# EAGLE board The Flying Jalapeno (EAGLE 7.6.0)
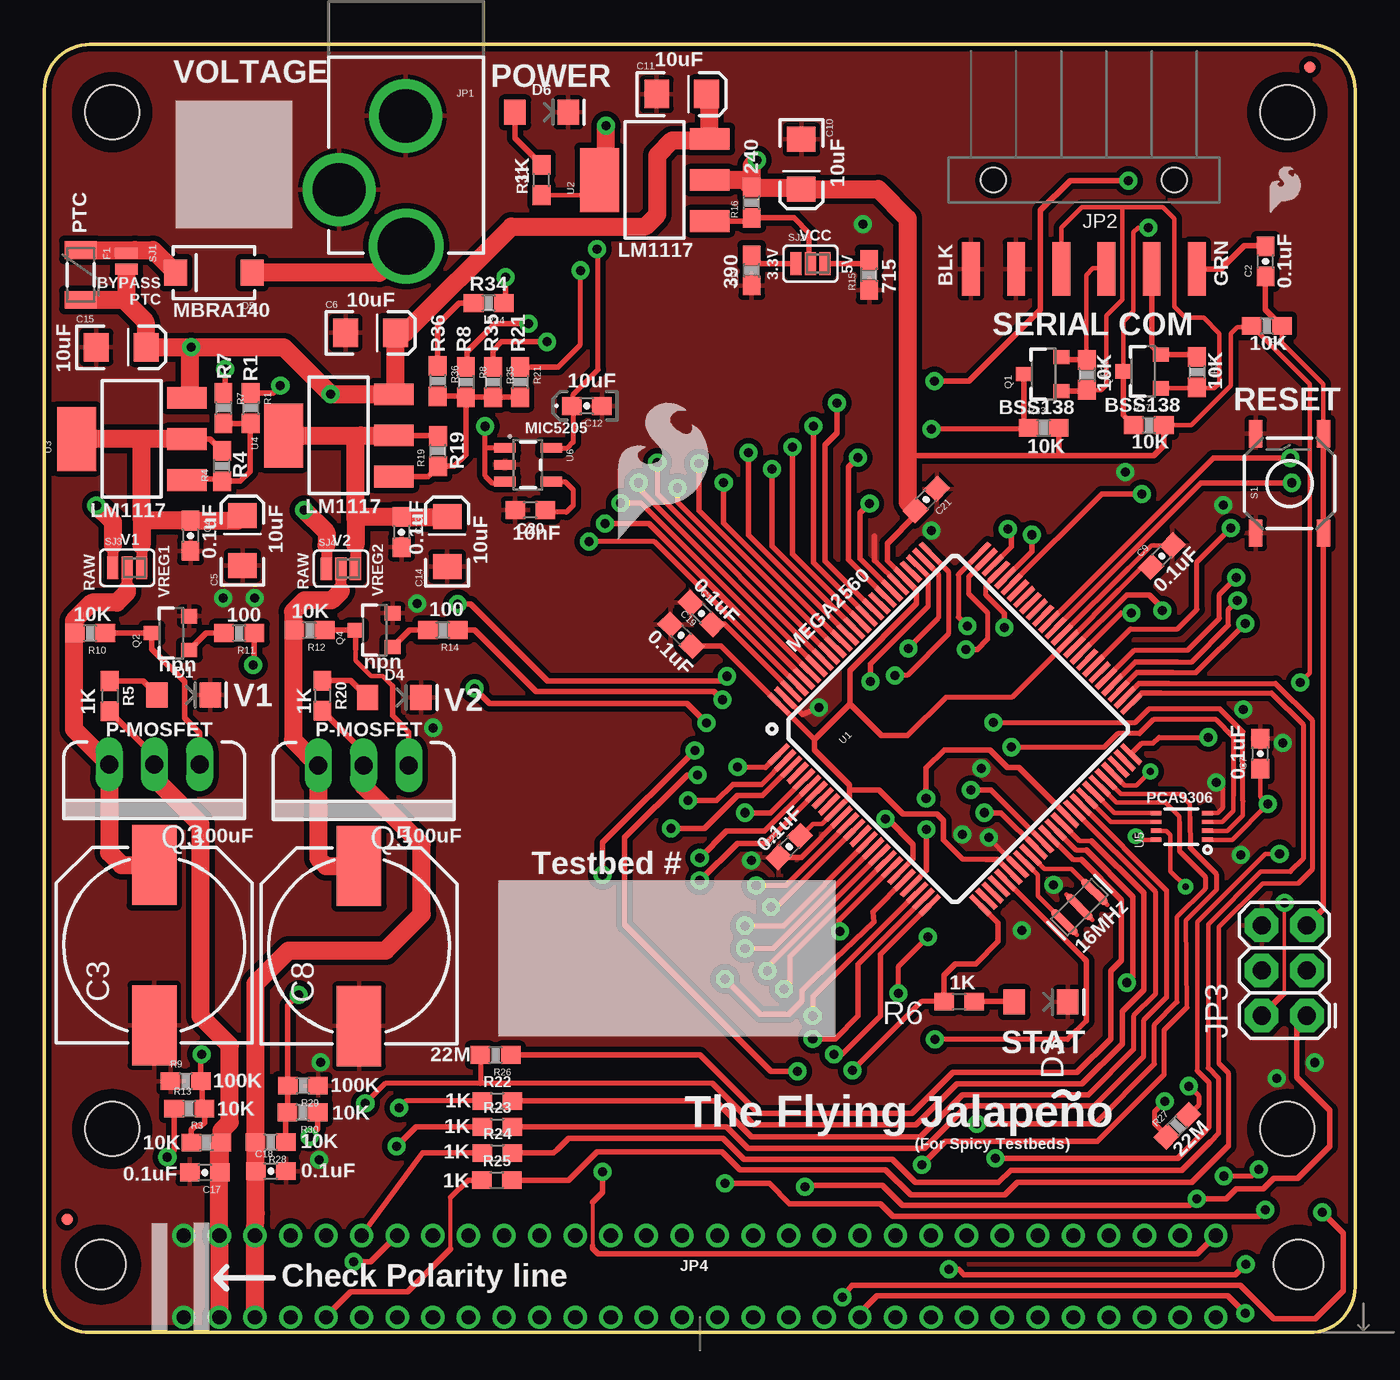
[diagram p1: board, top side]
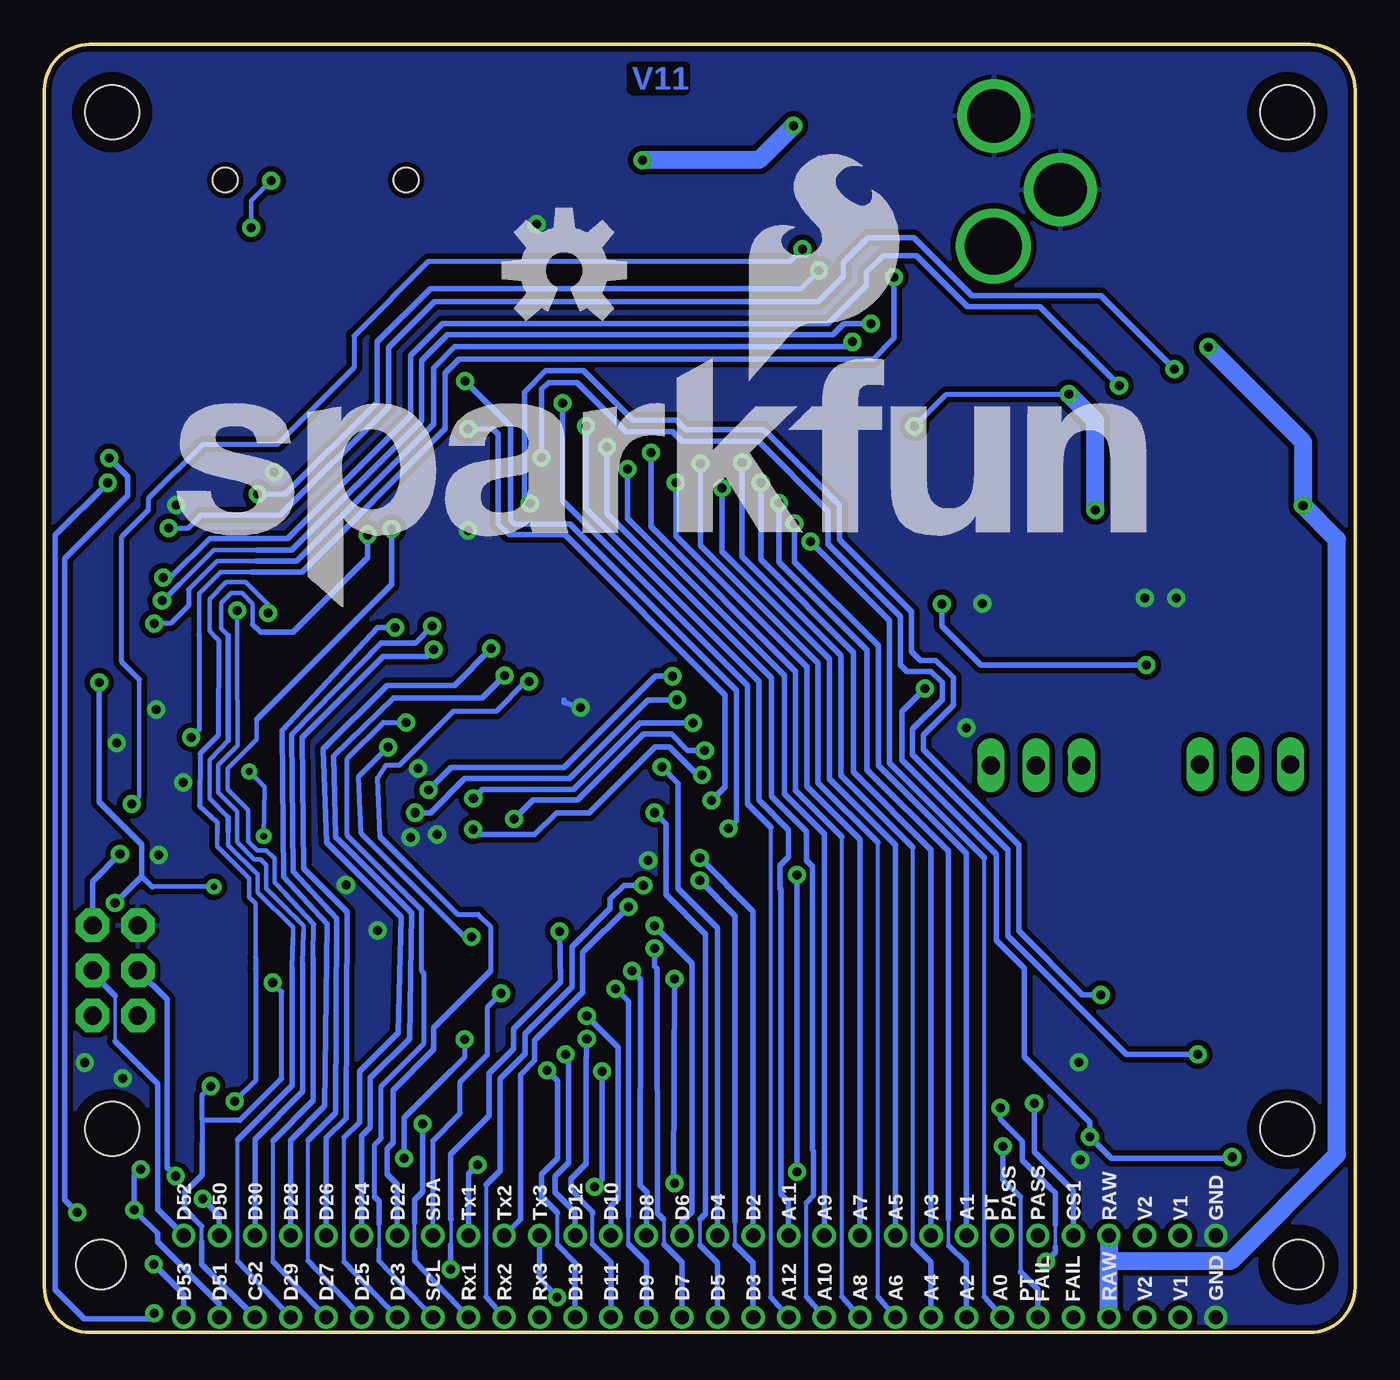
[diagram p2: board, bottom side, seen from below]

Size 73.66 x 72.39 mm. Coordinates in mm from the lower left corner, seen from the top.
Outline: 0,69.85 0,2.54 arc90 2.54,0 71.12,0 arc90 73.66,2.54 73.66,69.85 arc90 71.12,72.39 2.54,72.39 arc90 0,69.85
Copper layers (1*16): Top 0.035mm / dielectric 1.5mm / Bottom 0.035mm
Design rules "SparkFun *": minimum track width 7mil, minimum drill 15mil, track to track 8mil, track to pad 8mil, pad to pad 8mil, via to via 8mil, smd to smd 8mil, copper to edge 8mil, drill to drill 8mil, minimum pad ring 10mil, minimum via ring 10mil, stop-mask expansion 4mil, vias tented up to drill 20mil, thermal gap 10mil
Net classes: 0 default: width 0.203 mm; 1 BIG: width 0.203 mm; 2 POWER: width 0.203 mm; 10 12_mil: width 0.305 mm, drill 0.381 mm; 11 15_mil: width 0.381 mm, drill 0.381 mm
tRestrict: area 65.2,29.4 to 65.5,29.4

## Footprints (pad centres in the part's own frame; a part is rotated, then mirrored left to right if it is on the bottom)
0603-CAP = smd 1.1 x 1: 1 -0.85,0; 2 0.85,0
NIC_10X10.5_CAP = smd 4.5 x 2.5: + 4.5,0; - -4.5,0
EIA3216 = smd 1.4 x 1.6: A 1.4,0; C -1.4,0
0603-POL = smd 1.1 x 1: A 0.85,0; K -0.85,0
0603 = smd 1.1 x 1: 1 -0.85,0; 2 0.85,0
LED-1206 = smd 1.2 x 1.4: A -1.5,0; C 1.5,0
SMA-DIODE = smd 1.27 x 1.47: A -2.15,0; C 2.15,0
PTC-1206 = smd 1 x 1.8: 1 -1.4,0; 2 1.4,0
POWER_JACK_PTH_LOCK = drill 2.997 pad 4.115: GND 0.025,6.557; GNDBREAK 3.762,10.7 | drill 3.2 pad 4.115: PWR 0,13.878
FTDI_DEVICE_RA_SMT = smd 1 x 3: 1 -6.35,5; 2 -3.81,5; 3 -1.27,5; 4 1.27,5; 5 3.81,5; 6 6.35,5 | hole 1.4: -5.08,0; 5.08,0
2X3 = drill 1.016 pad 1.88 octagon: 1 0,0; 2 0,2.54; 3 2.54,0; 4 2.54,2.54; 5 5.08,0; 6 5.08,2.54
FLYING_JALAPENO_V3_F = drill 0.8 pad 1.25: 1 -29,5.45; 2 -27,5.45; 3 -25,5.45; 4 -23,5.45; 5 -21,5.45; 6 -19,5.45; 7 -17,5.45; 8 -15,5.45; 9 -13,5.45; 10 -11,5.45; 11 -9,5.45; 12 -7,5.45; 13 -5,5.45; 14 -3,5.45; 15 -1,5.45; 16 1,5.45; 17 3,5.45; 18 5,5.45; 19 7,5.45; 20 9,5.45; 21 11,5.45; 22 13,5.45; 23 15,5.45; 24 17,5.45; 25 19,5.45; 26 21,5.45; 27 23,5.45; 28 25,5.45; 29 27,5.45; 30 29,5.45; 31 -29,0.85; 32 -27,0.85; 33 -25,0.85; 34 -23,0.85; 35 -21,0.85; 36 -19,0.85; 37 -17,0.85; 38 -15,0.85; 39 -13,0.85; 40 -11,0.85; 41 -9,0.85; 42 -7,0.85; 43 -5,0.85; 44 -3,0.85; 45 -1,0.85; 46 1,0.85; 47 3,0.85; 48 5,0.85; 49 7,0.85; 50 9,0.85; 51 11,0.85; 52 13,0.85; 53 15,0.85; 54 17,0.85; 55 19,0.85; 56 21,0.85; 57 23,0.85; 58 25,0.85; 59 27,0.85; 60 29,0.85 | hole 2.794: 33.655,3.81; -33.655,3.81
MICRO-FIDUCIAL = smd 0.635 x 0.635: 1 0,0
SOT23-3 = smd 0.8 x 0.9: 1 -0.95,-1; 2 0.95,-1; 3 0,1.1
TO220V = drill 1.016 long: 1 -2.54,0; 2 0,0; 3 2.54,0
0603-RES = smd 1.1 x 1: 1 -0.85,0; 2 0.85,0
TACTILE-SWITCH-SMD = smd 1.524 x 0.762: 1 -2.794,1.905; 2 2.794,1.905; 3 -2.794,-1.905; 4 2.794,-1.905
PAD-JUMPER-2-NO_NO_SILK = smd 0.635 x 1.27: 1 -0.45,0; 2 0.45,0
PAD-JUMPER-3-2OF3_NC_BY_PASTE_YES_SILK_FULL_BOX = smd 0.635 x 1.27: 1 -0.813,0; 2 0,0; 3 0.813,0
STAND-OFF-TIGHT = hole 3.048: 0,0
TQFP100 = smd 1.5 x 0.3: 1 -8,6; 2 -8,5.5; 3 -8,5; 4 -8,4.5; 5 -8,4; 6 -8,3.5; 7 -8,3; 8 -8,2.5; 9 -8,2; 10 -8,1.5; 11 -8,1; 12 -8,0.5; 13 -8,0; 14 -8,-0.5; 15 -8,-1; 16 -8,-1.5; 17 -8,-2; 18 -8,-2.5; 19 -8,-3; 20 -8,-3.5; 21 -8,-4; 22 -8,-4.5; 23 -8,-5; 24 -8,-5.5; 25 -8,-6; 51 8,-6; 52 8,-5.5; 53 8,-5; 54 8,-4.5; 55 8,-4; 56 8,-3.5; 57 8,-3; 58 8,-2.5; 59 8,-2; 60 8,-1.5; 61 8,-1; 62 8,-0.5; 63 8,0; 64 8,0.5; 65 8,1; 66 8,1.5; 67 8,2; 68 8,2.5; 69 8,3; 70 8,3.5; 71 8,4; 72 8,4.5; 73 8,5; 74 8,5.5; 75 8,6 | smd 0.3 x 1.5: 26 -6,-8; 27 -5.5,-8; 28 -5,-8; 29 -4.5,-8; 30 -4,-8; 31 -3.5,-8; 32 -3,-8; 33 -2.5,-8; 34 -2,-8; 35 -1.5,-8; 36 -1,-8; 37 -0.5,-8; 38 0,-8; 39 0.5,-8; 40 1,-8; 41 1.5,-8; 42 2,-8; 43 2.5,-8; 44 3,-8; 45 3.5,-8; 46 4,-8; 47 4.5,-8; 48 5,-8; 49 5.5,-8; 50 6,-8; 76 6,8; 77 5.5,8; 78 5,8; 79 4.5,8; 80 4,8; 81 3.5,8; 82 3,8; 83 2.5,8; 84 2,8; 85 1.5,8; 86 1,8; 87 0.5,8; 88 0,8; 89 -0.5,8; 90 -1,8; 91 -1.5,8; 92 -2,8; 93 -2.5,8; 94 -3,8; 95 -3.5,8; 96 -4,8; 97 -4.5,8; 98 -5,8; 99 -5.5,8; 100 -6,8
SOT223 = smd 1.219 x 2.235: 1 -2.311,-3.099; 2 0,-3.099; 3 2.311,-3.099 | smd 3.6 x 2.2: 4 0,3.099
PCA9306DC-1:1 = smd 0.25 x 0.602: 1 -0.73,-1.446; 2 -0.23,-1.446; 3 0.27,-1.446; 4 0.77,-1.446; 5 0.77,1.431; 6 0.27,1.431; 7 -0.23,1.431; 8 -0.73,1.431
SOT23-5 = smd 0.55 x 1.2: 1 -0.95,-1.3; 2 0,-1.3; 3 0.95,-1.3; 4 0.95,1.3; 5 -0.95,1.3
RESONATOR-SMD = smd 0.45 x 1.905: 1 -1.2,0; 2 0,0; 3 1.2,0

## Placement (x,y rotation side)
C1  0.1uF  [0603-CAP]  36.93,40.41 315 top
C2  0.1uF  [0603-CAP]  68.63,60.2 90 top
C3  100uF  [NIC_10X10.5_CAP]  6.17,21.77 90 top
C4  0.1uF  [0603-CAP]  8.2,44.78 270 top
C5  10uF  [EIA3216]  11.13,44.5 90 top
C6  10uF  [EIA3216]  18.33,56.18 0 top
C7  0.1uF  [0603-CAP]  68.34,32.53 90 top
C8  100uF  [NIC_10X10.5_CAP]  17.68,21.72 90 top
C9  0.1uF  [0603-CAP]  62.79,43.64 45 top
C10  10uF  [EIA3216]  42.55,65.66 270 top
C11  10uF  [EIA3216]  35.81,69.6 0 top
C12  10uF  [0603-POL]  30.48,52.07 180 top
C13  0.1uF  [0603-CAP]  20.07,44.98 270 top
C14  10uF  [EIA3216]  22.63,44.45 90 top
C15  10uF  [EIA3216]  4.32,55.37 0 top
C17  0.1uF  [0603-CAP]  9.02,8.99 180 top
C18  0.1uF  [0603-CAP]  12.73,9.07 0 top
C19  0.1uF  [0603-CAP]  35.78,39.19 315 top
C20  10nF  [0603]  27.3,46.23 180 top
C21  0.1uF  [0603-CAP]  49.56,46.81 225 top
C22  0.1uF  [0603-CAP]  41.86,27.3 45 top
D1  RED  [LED-1206]  7.82,35.83 0 top
D3  RED  [LED-1206]  56.01,18.57 0 top
D4  RED  [LED-1206]  19.66,35.69 0 top
D5  MBRA140  [SMA-DIODE]  9.53,59.56 180 top
D6  RED  [LED-1206]  27.94,68.58 0 top
F1  [PTC-1206]  2.03,59.44 270 top
FRAME1  FRAME-LEDGER  [CREATIVE_COMMONS]  -1.27,-12.7 0 top  (outside the outline)
JP1  7V  [POWER_JACK_PTH_LOCK]  20.32,74.93 180 top
JP2  FTDI  [FTDI_DEVICE_RA_SMT]  58.42,64.77 180 top
JP3  [2X3]  70.95,17.81 90 top
JP4  2x30 RA FEMALE HEADER  [FLYING_JALAPENO_V3_F]  36.83,0 0 top
JP5  FIDUCIALUFIDUCIAL  [MICRO-FIDUCIAL]  1.27,6.35 90 top
JP8  FIDUCIALUFIDUCIAL  [MICRO-FIDUCIAL]  71.12,71.12 90 top
LOGO1  SFE_LOGO_NAME_FLAME.5_INCH  [SFE_LOGO_NAME_FLAME_.5]  67.03,40.46 0 bottom
LOGO2  SFE_LOGO_FLAME.3_INCH  [SFE_LOGO_FLAME_.3]  31.75,44.45 0 top
LOGO3  SFE_LOGO_FLAME.1_INCH  [SFE_LOGO_FLAME_.1]  68.58,62.61 0 top
LOGO4  OSHW-LOGOL  [OSHW-LOGO-L]  44.45,59.69 0 bottom
Q1  BSS138, 200mA/50V  [SOT23-3]  56.15,53.86 90 top
Q2  MMBT2222A  [SOT23-3]  7.14,39.31 90 top
Q3  NDP6020P  [TO220V]  6.17,31.93 180 top
Q4  MMBT2222A  [SOT23-3]  18.58,39.47 90 top
Q5  NDP6020P  [TO220V]  17.93,31.88 180 top
Q6  BSS138, 200mA/50V  [SOT23-3]  61.73,54.01 90 top
R1  715  [0603-RES]  11.58,51.94 270 top
R2  10K  [0603-RES]  68.7,56.57 180 top
R3  10K  [0603-RES]  9.11,10.67 0 top
R4  240  [0603-RES]  9.98,48.69 90 top
R5  1k  [0603]  3.67,35.76 270 top
R6  1k  [0603]  51.41,18.59 0 top
R7  390  [0603-RES]  10.06,51.94 270 top
R8  390  [0603-RES]  23.69,53.42 270 top
R9  100k  [0603-RES]  7.94,14.12 0 top
R10  10K  [0603-RES]  2.57,39.31 180 top
R11  100  [0603-RES]  10.95,39.31 180 top
R12  10K  [0603-RES]  14.9,39.47 180 top
R13  10K  [0603-RES]  8.14,12.59 0 top
R14  100  [0603-RES]  22.39,39.47 180 top
R15  715  [0603-RES]  46.35,59.44 90 top
R16  240  [0603-RES]  39.75,63.5 90 top
R17  10K  [0603-RES]  62.06,50.99 0 top
R18  390  [0603-RES]  39.75,59.69 90 top
R19  240  [0603-RES]  22.12,49.53 90 top
R20  1k  [0603]  15.62,35.79 270 top
R21  715  [0603-RES]  26.73,53.42 270 top
R22  1k  [0603]  25.45,13 0 top
R23  1k  [0603]  25.45,11.56 0 top
R24  1k  [0603]  25.45,10.08 0 top
R25  1k  [0603]  25.43,8.56 0 top
R26  22M  [0603-RES]  25.35,15.6 180 top
R27  22M  [0603-RES]  63.68,11.61 45 top
R28  10K  [0603-RES]  12.71,10.69 180 top
R29  100k  [0603-RES]  14.53,13.87 180 top
R30  10K  [0603-RES]  14.5,12.37 180 top
R31  1k  [0603]  27.94,64.77 90 top
R32  10K  [0603-RES]  58.59,53.82 270 top
R33  10K  [0603-RES]  56.16,50.84 0 top
R34  100  [0603-RES]  24.97,57.85 180 top
R35  470  [0603-RES]  25.21,53.42 270 top
R36  470  [0603-RES]  22.1,53.47 270 top
R37  10K  [0603-RES]  64.77,53.98 270 top
S1  [TACTILE-SWITCH-SMD]  69.98,47.71 90 top
SJ1  PTC Bypass  [PAD-JUMPER-2-NO_NO_SILK]  4.61,60.21 270 top
SJ2  [PAD-JUMPER-3-2OF3_NC_BY_PASTE_YES_SILK_FULL_BOX]  43.05,60.07 0 top
SJ3  [PAD-JUMPER-3-2OF3_NC_BY_PASTE_YES_SILK_FULL_BOX]  4.65,42.98 0 top
SJ4  [PAD-JUMPER-3-2OF3_NC_BY_PASTE_YES_SILK_FULL_BOX]  16.66,42.93 0 top
STANDOFF1  STAND-OFFTIGHT  [STAND-OFF-TIGHT]  3.81,11.43 0 top
STANDOFF2  STAND-OFFTIGHT  [STAND-OFF-TIGHT]  69.85,11.43 0 top
STANDOFF3  STAND-OFFTIGHT  [STAND-OFF-TIGHT]  69.85,68.58 0 top
STANDOFF4  STAND-OFFTIGHT  [STAND-OFF-TIGHT]  3.81,68.58 0 top
U1  ATMEGA2560AU  [TQFP100]  51.17,33.92 45 top
U2  LM1117  [SOT223]  34.29,64.77 90 top
U3  LM1117  [SOT223]  4.9,50.22 90 top
U4  LM1117  [SOT223]  16.54,50.42 90 top
U5  PCA9306  [PCA9306DC-1:1]  63.91,28.42 90 top
U6  3.3V MIC5205  [SOT23-5]  27.18,48.77 270 top
Y1  16MHZ  [RESONATOR-SMD]  58.17,23.91 225 top

## Tracks (layer width: path | path; a pad name or v marks a point on that pad's centre or on a via)
3.3V  (via drill 0.51)
  Top 0.254: U5.1 66.76,27.69 v68.76,29.69 68.34,30.11 C7.1
  Top 0.279: U6.5 29.4,49.72 29.72,50.04 29.72,51.98 | 29.72,51.98 C12.A | 29.72,51.98 29.72,52.7 31.11,54.1 31.11,60.81 v31.05,60.88
  Bottom 0.254: 68.33,36.7 68.33,30.12 v68.76,29.69
  Bottom 0.279: 68.33,36.7 69.34,37.72 69.34,44.7 67.82,46.23 67.82,46.86 64.77,49.91 60.58,49.91 56.26,54.23 56.26,56.01 52.07,60.2 31.73,60.2 v31.05,60.88
31/CAPRETURN2  (via drill 0.51)
  Top 0.279: U1.59 60.52,40.44 v61.09,40.44 | R27.1 63.08,11.04 62.41,11.71 62.41,12.42 v62.97,12.98
  Bottom 0.254: 64.01,39.04 64.39,39.42 64.39,41.22 63.45,42.16 62.36,42.16 61.01,40.82 v61.09,40.44 | 63.94,28.04 63.94,27.32 62.15,25.53 62.15,24.46 61.8,24.11 61.8,20.47
  Bottom 0.279: 64.01,39.04 63.88,38.91 63.91,33.55 64.92,32.54 64.95,29.59 63.94,28.69 63.94,28.04 | 61.8,21.08 61.8,20.47 61.8,14.14 v62.97,12.98
33/V1_3.3V  (via drill 0.51)
  Top 0.279: U1.57 61.04,39.55 63.68,39.55 64.77,40.64 64.77,43.31 v66.67,45.21
  Top 0.305: v10.16,54.15 10.16,52.9 R7.1
  Bottom 0.279: v66.67,45.21 65.58,45.21 64.99,45.81
  Bottom 0.305: 64.99,45.81 64.85,45.95 60.4,45.95 54.33,52.02 54.33,55.35 51.74,57.94 30.18,57.94 28.75,59.36 28.75,60.15 27.38,61.52 24.79,61.52 21.54,58.27 14.28,58.27 v10.16,54.15
35/V1_5V  (via drill 0.51)
  Top 0.279: U1.55 61.27,38.35 64.26,38.35 66.04,40.13 66.04,41.48 v66.98,42.42
  Top 0.305: 12.97,52.92 v13.26,53.21 12.84,52.79 R1.1
  Bottom 0.279: 64.39,44.63 66.6,42.42 v66.98,42.42
  Bottom 0.305: 64.39,44.63 59.99,44.63 53.09,51.54 53.09,54.89 51.28,56.69 29.62,56.69 27.46,58.85 27.46,59.59 26.52,60.53 24.66,60.53 21.79,57.66 17.7,57.66 v13.26,53.21
36/V2_3.3V  (via drill 0.51)
  Top 0.279: U1.54 61.31,37.69 | 63.68,37.69 64.49,37.69 66.55,39.75 66.55,40.64 v67.06,41.15
  Top 0.305: 61.31,37.69 63.68,37.69 | R8.1 23.75,54.33 23.75,55.12 25.32,56.69 v27.2,56.69
  Bottom 0.254: 66.09,42.04 64.16,43.97 61.7,43.97
  Bottom 0.279: 66.09,42.04 66.98,41.15 v67.06,41.15
  Bottom 0.305: 61.7,43.97 59.77,43.97 52.48,51.26 52.48,54.61 51,56.08 29.34,56.08 28.73,56.69 v27.2,56.69
37/V2_3.7V  (via drill 0.51)
  Top 0.279: U1.53 61.41,37.08 | 63.42,37.08 64.72,37.08 v67.49,39.85
  Top 0.305: 61.41,37.08 63.42,37.08 | R35.1 25.21,55.18 25.7,55.68 v28.25,55.68
  Bottom 0.254: 61.77,43.36 63.96,43.36 65.56,41.76
  Bottom 0.279: 65.56,41.76 65.56,40.87 66.57,39.85 v67.49,39.85
  Bottom 0.305: 61.77,43.36 59.49,43.36 51.79,51.05 51.79,54.2 50.6,55.4 28.52,55.4 v28.25,55.68
38/V2_4.2V  (via drill 0.51)
  Top 0.279: U1.50 61.69,33.12 62.31,33.12 62.64,33.45 v65.41,33.45
  Top 0.305: v25.91,59.31 25.91,57.94 R34.1
  Bottom 0.254: 64.97,39.22 64.97,41.53 63.75,42.75 62,42.75
  Bottom 0.279: 64.97,39.22 64.97,33.88 v65.41,33.45
  Bottom 0.305: 62,42.75 59.18,42.75 51.13,50.8 51.13,53.92 50.34,54.71 27.08,54.71 25.91,55.88 v25.91,59.31
39/V2_5V  (via drill 0.51)
  Top 0.279: U1.70 59.42,47.12 | 28.87,54.27 30.12,55.52 v30.12,59.69
  Top 0.305: 59.42,47.12 v61.67,47.12 | R21.1 28.87,54.27
  Bottom 0.279: 31.52,58.67 31.14,58.67 v30.12,59.69
  Bottom 0.305: v61.67,47.12 60.12,47.12 54.97,52.27 54.97,55.68 51.97,58.67 31.52,58.67
40/FAIL
  Top 0.254: 66.02,15.11 66.02,22.78 68.48,25.25 70.48,25.25
  Top 0.279: U1.52 61.51,36.47 | 63.17,36.47 69.19,36.47 71.25,34.42 71.25,26.01 70.48,25.25 | 66.02,15.11 66.53,14.59 66.53,10.48
  Top 0.305: R25.2 29.46,8.56 31.06,10.16 38.08,10.16 39.09,9.14 47.27,9.14 48.69,7.72 53.98,7.72 54.69,8.43 64.49,8.43 66.53,10.48 | 61.51,36.47 63.17,36.47
41/PASS
  Top 0.254: 65.41,14.86 65.41,22.94 68.38,25.91 70.03,25.91
  Top 0.279: U1.51 61.68,35.94 | 62.74,35.94 68.96,35.94 70.74,34.16 70.74,26.62 70.03,25.91 | 65.41,14.86 65.99,14.28 65.99,11.18 65.52,10.71
  Top 0.305: 65.52,10.71 63.93,9.12 54.3,9.12 53.62,8.43 48.95,8.43 47.65,9.73 39.32,9.73 38.12,10.92 29.46,10.92 28.96,10.41 28.83,10.29 28.63,10.08 R24.2 | 62.74,35.94 61.68,35.94
42/PT_FAIL
  Top 0.279: U1.42 63.07,24.85 63.07,18.82 61.77,17.53 61.77,15.49 59,12.72
  Top 0.305: R23.2 38.33,11.56 39.55,10.34 49.45,10.34 51.84,12.72 59,12.72
43/PT_PASS
  Top 0.279: U1.41 62.43,24.78 62.43,19 61.21,17.78 61.21,15.9 58.67,13.36
  Top 0.305: R22.2 37.72,13.01 39.73,11 49.23,11 51.59,13.36 58.67,13.36
44/PT_CTRL  (via drill 0.51)
  Top 0.305: U1.40 54.75,31.75 54.13,31.75 53.14,32.74 50.57,32.74 49.55,31.73 v49.55,30.02 | v37.21,34.27 36.12,35.36 25.02,35.36 v24.18,36.2 | 7.16,10.11 v6.91,9.86 7.29,10.24 R13.1 | R30.1 15.35,11.44 v14.91,11
  Bottom 0.305: v49.55,30.02 49.05,30.53 43.92,30.53 40.18,34.27 v37.21,34.27 | v24.18,36.2 25.48,34.9 25.48,32.18 20.17,26.87 20.17,22.02 18.59,20.45 18.59,15.49 14.91,11.81 v14.91,11 13.69,9.78 6.99,9.78 v6.91,9.86
45/CAPSENSE1  (via drill 0.51)
  Top 0.279: U1.39 58.14,27.66 58.85,27.62 | 37.54,13.99 24.5,13.99 | 24.5,13.99 19.15,13.99 v18.03,12.88 | R26.2 24.5,13.99
  Top 0.305: 58.85,27.62 61.8,24.69 61.8,19.25 60.58,18.03 60.58,16.23 58.32,13.97 51.28,13.97 48.97,11.66 39.88,11.66 37.54,13.99
  Bottom 0.305: v18.03,12.88 18.03,10.16 15.83,7.96 JP4.5
46/CAPSENSE2  (via drill 0.51)
  Top 0.279: U1.38 57.96,27.13 58.55,27.13 | 64.41,12.34 R27.2 | 64.41,12.34 | 64.41,12.34 64.9,12.83 64.9,13.26 v64.31,13.84
  Top 0.305: 58.55,27.13 61.16,24.49 61.16,19.99 v60.83,19.66
  Bottom 0.229: 64.82,5.08 64.82,5.97
  Bottom 0.279: 64.8,11.91 62.69,11.91 60.33,14.28 60.33,19.15 v60.83,19.66 | 64.8,11.91 64.8,10.62 | 64.8,11.91 64.8,13.36 v64.31,13.84
  Bottom 0.305: JP4.58 64.82,3.84 64.82,5.08 | 64.8,10.62 64.8,8.87 65.79,7.87 65.79,6.93 64.82,5.97
47/CAPRETURN1
  Top 0.279: U1.37 57.79,26.59 58.27,26.59
  Top 0.305: 58.27,26.59 60.53,24.31 60.53,20.9 59.94,20.32 59.94,16.51 58.04,14.61 51.05,14.61 48.77,12.32 40.13,12.32 36.85,15.6 R26.1
48/PWR_CTRL_1  (via drill 0.51)
  Top 0.279: U1.36 53.2,30.48
  Top 0.305: 53.2,30.48 v52.07,30.48 | v11.73,37.52 11.8,37.58 R11.1 | v38.35,36.88 38.1,36.63 28.27,36.63 23.95,40.95 v23.22,40.95
  Bottom 0.305: v52.07,30.48 50.8,31.75 44.45,31.75 39.32,36.88 v38.35,36.88 | v11.73,37.52 21.03,37.52 23.22,39.7 v23.22,40.95
49/PWR_CTRL_2  (via drill 0.51)
  Top 0.279: U1.35 53.76,29.21
  Top 0.305: 53.76,29.21 v52.83,29.21 | v38.1,35.56 37.64,36.02 27.64,36.02 24.18,39.47 R14.1
  Bottom 0.305: v38.1,35.56 39.73,35.56 44.15,31.14 50.04,31.14 51.97,29.21 v52.83,29.21
A0  (via drill 0.51)
  Top 0.279: U1.97 34.28,44.45 v30.61,44.45
  Bottom 0.229: 20.83,2 20.83,26.67
  Bottom 0.305: JP4.37 20.83,2 | 20.83,26.67 26.16,32 26.16,40.01 v30.61,44.45
A1  (via drill 0.51)
  Top 0.305: U1.96 33.97,45.47 v31.5,45.47
  Bottom 0.305: JP4.8 21.83,26.91 26.8,31.88 26.8,38.61 31.5,43.31 v31.5,45.47
A2  (via drill 0.51)
  Top 0.279: U1.95 33.53,46.61
  Top 0.305: 33.53,46.61 v32.38,46.61
  Bottom 0.203: 22.86,6.35 22.86,4.9 22.84,4.88
  Bottom 0.305: JP4.38 21.83,3.92 22.84,4.88 | v32.38,46.61 32.38,43.31 27.43,38.35 27.43,31.62 22.86,27.05 22.86,6.35
A3  (via drill 0.51)
  Top 0.279: U1.94 33.4,47.45
  Top 0.305: 33.4,47.45 v33.4,47.75
  Bottom 0.305: JP4.9 23.83,27.13 28.19,31.5 28.19,38.23 33.4,43.43 v33.4,47.75
A4  (via drill 0.51)
  Top 0.279: U1.93 34.44,47.11
  Top 0.305: 34.44,47.11 v34.44,48.9
  Bottom 0.229: 24.84,4.95 24.84,27.25
  Bottom 0.305: JP4.39 23.83,3.94 24.84,4.95 | 24.84,27.25 28.88,31.29 28.88,38.05 34.44,43.61 v34.44,48.9
A5  (via drill 0.51)
  Top 0.279: U1.92 35.59,46.68
  Top 0.305: 35.59,46.68 v35.59,47.45
  Bottom 0.305: JP4.10 25.83,27.41 29.54,31.11 29.54,37.85 35.59,43.89 v35.59,47.45
A6  (via drill 0.51)
  Top 0.279: 36.78,46.19 U1.91
  Top 0.305: v36.78,48.84 36.78,46.19
  Bottom 0.229: 26.82,1.99 26.82,27.53
  Bottom 0.305: JP4.40 26.82,1.99 | 26.82,27.53 30.18,30.89 30.18,37.62 36.78,44.22 v36.78,48.84
A7  (via drill 0.51)
  Top 0.279: 38.18,45.5 U1.90
  Top 0.305: v38.18,47.78 38.18,45.5
  Bottom 0.305: JP4.11 27.83,27.7 30.81,30.68 30.81,37.39 38.18,44.76 v38.18,47.78
A8  (via drill 0.51)
  Top 0.279: 39.57,44.81 U1.89
  Top 0.305: v39.57,49.45 39.57,44.81
  Bottom 0.229: 28.83,2 28.83,27.84
  Bottom 0.305: JP4.41 28.83,2 | 28.83,27.84 31.45,30.45 31.45,37.16 39.57,45.29 v39.57,49.45
A9  (via drill 0.51)
  Top 0.279: 40.89,44.2 U1.88
  Top 0.305: v40.89,48.51 40.89,44.2
  Bottom 0.305: JP4.12 29.83,28.03 32.08,30.28 32.08,36.93 40.89,45.74 v40.89,48.51
A10  (via drill 0.51)
  Top 0.279: 42.04,43.76 U1.87
  Top 0.305: v42.04,49.76 42.04,43.76
  Bottom 0.229: 30.84,2.01 30.84,7.29
  Bottom 0.305: JP4.42 30.84,2.01 | 30.84,7.29 30.43,7.7 30.43,10.19 30.5,10.26 30.5,26.19 30.84,26.52 30.84,28.17 32.79,30.12 32.79,36.78 42.04,46.02 v42.04,49.76
A11  (via drill 0.51)
  Top 0.279: 43.23,43.27 U1.86
  Top 0.305: v43.23,50.95 43.23,43.27
  Bottom 0.305: JP4.13 31.83,7.34 32.26,7.77 32.26,8.89 32.26,8.99 32.26,24.89 32.31,24.94 32.31,26.24 31.83,26.72 31.83,28.25 33.5,29.92 33.5,36.58 43.23,46.3 v43.23,50.95
A12  (via drill 0.51)
  Top 0.279: 43.87,43.35 U1.85
  Top 0.305: v44.55,52.22 44.55,50.55 43.87,49.86 43.87,43.35
  Bottom 0.229: 32.82,1.99 32.82,28.37
  Bottom 0.305: JP4.43 32.82,1.99 | 32.82,28.37 34.14,29.69 34.14,36.35 44.55,46.76 v44.55,52.22
A14/PT_READ_V1  (via drill 0.51)
  Top 0.279: U1.83 45.19,43.44
  Top 0.305: 45.19,43.44 45.19,48.64 v45.72,49.17 | v8.84,15.62 8.79,15.57 R9.2 8.86,13.79 8.86,12.71 R13.2 8.99,11.79 8.81,11.61 8.48,11.61 8.26,11.38 R3.1
  Bottom 0.305: v45.72,49.17 45.72,53.01 45.34,53.39 43.74,53.39 40.97,50.62 38.35,50.62 37.82,50.09 33.53,50.09 29.62,46.18 29.62,44.3 25.55,40.23 25.55,37.52 25.2,37.16 23.82,37.16 23.19,36.52 23.19,35.59 24.87,33.91 24.87,32.49 19.51,27.13 19.51,22.28 12.85,15.62 v8.84,15.62
A15/PT_READ_V2  (via drill 0.51)
  Top 0.279: U1.82 45.85,43.49
  Top 0.305: R28.1 13.56,12.28 R30.2 13.65,13.84 R29.2 13.68,18.38 v14.28,18.97 | 45.85,43.49 45.85,46.05 v46.38,46.58
  Bottom 0.305: v46.38,46.58 46.69,46.89 46.69,52.86 45.49,54.05 43.36,54.05 40.59,51.28 38.12,51.28 37.59,50.75 33.22,50.75 28.98,46.51 28.98,44.55 24.94,40.51 24.94,38.28 24.43,37.77 23.55,37.77 22.58,36.8 22.58,35.26 24.26,33.58 24.26,32.77 18.9,27.41 18.9,22.55 15.32,18.97 v14.28,18.97
AREF
  Top 0.279: U1.98 38.21,39.81
  Top 0.305: 38.21,39.81 C1.2
D2  (via drill 0.51)
  Top 0.279: 40.48,28.18 U1.6
  Top 0.305: v36.83,26.67 38.34,28.18 40.48,28.18
  Bottom 0.305: JP4.14 33.83,23.67 v36.83,26.67
D3  (via drill 0.51)
  Top 0.279: 40.53,27.49 U1.7
  Top 0.305: v36.83,25.4 38.95,27.49 40.53,27.49
  Bottom 0.203: 34.85,6.25 34.85,4.93
  Bottom 0.305: JP4.44 33.83,3.91 34.65,4.72 34.85,4.93 | v36.83,25.4 34.85,23.42 34.85,6.25
D4  (via drill 0.51)
  Top 0.279: 40.52,31.75 U1.1
  Top 0.305: v38.96,31.77 40.52,31.75
  Bottom 0.305: JP4.15 35.83,22.72 38.05,24.94 38.05,30.86 v38.96,31.77
D5  (via drill 0.51)
  Top 0.279: 40.81,29.21 U1.5
  Top 0.305: v39.37,29.21 40.81,29.21
  Bottom 0.203: 36.83,6.35 36.83,4.9
  Bottom 0.305: JP4.45 35.83,3.9 36.83,4.9 | v39.37,29.21 38.73,28.57 38.73,24.61 36.5,22.38 36.5,6.68 36.83,6.35
D6  (via drill 0.51)
  Top 0.279: 41.53,22.86 U1.15
  Top 0.305: v39.37,22.86 41.53,22.86
  Bottom 0.305: v39.37,22.86 37.26,20.75 37.26,6.78 37.83,6.21 JP4.16
D7  (via drill 0.51)
  Top 0.279: 40.97,21.59 U1.16
  Top 0.305: v39.37,21.59 40.97,21.59
  Bottom 0.203: 38.86,6.35 38.84,6.33 38.84,4.95
  Bottom 0.305: JP4.46 37.83,3.95 38.84,4.95 | 38.86,6.35 39.22,6.71 39.24,20.45 39.37,20.57 v39.37,21.59
D8  (via drill 0.51)
  Top 0.279: 40.64,20.56 U1.17
  Top 0.305: v40.64,20.32 40.64,20.56
  Bottom 0.305: JP4.17 39.8,7.87 40.18,8.26 40.16,19.18 40.16,19.84 v40.64,20.32
D9  (via drill 0.51)
  Top 0.279: 41.91,21.12 U1.18
  Top 0.305: 41.91,21.12 41.91,19.66 v41.55,19.3
  Bottom 0.229: 40.84,4.95 40.84,6.55
  Bottom 0.305: JP4.47 39.83,3.94 40.84,4.95 | v41.55,19.3 40.84,18.59 40.84,6.55
D10  (via drill 0.51)
  Top 0.279: 43.18,18.86 U1.23
  Top 0.305: v43.18,17.78 43.18,18.86
  Bottom 0.305: JP4.18 41.83,7.12 41.43,7.52 41.43,16.03 v43.18,17.78
D11  (via drill 0.51)
  Top 0.279: 45.72,20.69 U1.24
  Top 0.305: v43.18,16.51 44.45,16.51 45.72,17.78 45.72,20.69
  Bottom 0.229: 42.85,4.95 42.85,6.66
  Bottom 0.305: JP4.48 41.83,3.93 42.85,4.95 | v43.18,16.51 43.18,15.47 43.23,15.42 43.23,9.47 44.07,8.64 44.07,8 42.85,6.78 42.85,6.66
D12  (via drill 0.51)
  Top 0.279: 46.99,21.25 U1.25 | v44.37,15.62 44.83,15.62 46.99,17.78
  Top 0.305: 46.99,17.78 46.99,21.25
  Bottom 0.305: JP4.19 43.83,6.75 44.96,7.87 44.96,8.76 44.2,9.53 44.2,15.44 v44.37,15.62
D13  (via drill 0.51)
  Top 0.279: U1.26 53.59,23.01 | R6.1 49.28,18.59 v45.41,14.73
  Top 0.305: 53.59,23.01 53.59,21.97 52.35,20.73 51.21,20.73 50.56,20.08 R6.1
  Bottom 0.229: 44.83,4.93 44.83,6.73
  Bottom 0.305: JP4.49 43.83,3.93 44.83,4.93 | 44.83,6.73 45.72,7.62 45.72,8.89 44.83,9.78 44.83,12.19 44.83,14.15 v45.41,14.73
D22  (via drill 0.51)
  Top 0.279: U1.78 49.68,42.48 49.68,40.82 46.43,37.57
  Top 0.305: v46.43,36.58 46.43,37.57
  Bottom 0.279: 54.8,27.84 54.94,31.17 54.48,31.88 53.72,31.88 50.67,34.92 48.26,34.92 46.61,36.58 v46.43,36.58 | 53.02,26.07 50.45,23.5 49.28,23.5 48.59,22.81 48.59,20.32
  Bottom 0.305: 54.8,27.84 53.02,26.07 | JP4.24 53.83,8.31 54.41,8.89 54.41,10.31 54.08,10.64 54.08,13.61 51.79,15.9 51.79,17.12 48.59,20.32
D23  (via drill 0.51)
  Top 0.279: 48.56,38.48 50.24,40.16 50.24,42.63 U1.77
  Top 0.305: v48.56,38.43 48.56,38.48
  Bottom 0.229: 56.82,3.96 56.82,10.97
  Bottom 0.305: JP4.54 56.82,3.96 | 56.82,10.97 55.96,11.81 55.96,14.68 53.8,16.84 53.62,23.34 57.81,27.53 57.99,32.79 54.41,36.37 50.62,36.37 v48.56,38.43
D24  (via drill 0.51)
  Top 0.279: U1.76 50.8,42.77 50.8,39.24 48.49,36.93 v47.8,36.93
  Bottom 0.305: JP4.25 55.83,11.05 55.35,11.53 55.35,14.3 53.14,16.51 53.03,23.57 57.3,27.84 57.4,32.41 54.03,35.66 49.07,35.66 v47.8,36.93
D25  (via drill 0.51)
  Top 0.279: U1.75 51.36,42.59 51.36,40.21 v51.87,39.7
  Bottom 0.229: 58.85,4.02 58.85,10.79
  Bottom 0.305: JP4.55 58.85,4.02 | 58.85,10.79 57.3,12.34 57.23,23.27 59.69,25.91 59.77,33.6 54.74,38.76 52.81,38.76 v51.87,39.7
D26  (via drill 0.51)
  Top 0.279: 53.01,38.96 53.01,40.46 51.94,41.53 51.94,42.47 U1.74
  Top 0.305: 53.01,38.96 52.43,38.38 v51.79,38.38
  Bottom 0.305: JP4.26 57.83,10.93 56.72,12.04 56.64,23.62 59.11,26.09 59.18,33.45 54.63,38 52.17,38 v51.79,38.38
D27  (via drill 0.51)
  Top 0.279: 54.36,44.17 U1.73
  Top 0.305: v54.15,45.16 54.36,44.96 54.36,44.17
  Bottom 0.229: 60.81,3.98 60.81,10.77
  Bottom 0.254: 61.75,34.44 61.75,33.33 63.37,31.7 63.37,30.53 62.21,29.36 62.21,27.59 61.7,27.08 61.19,27.08 60.73,26.64 60.73,25.3 60.11,24.65
  Bottom 0.279: 58.55,21.03 58.52,22.96 60.11,24.65
  Bottom 0.305: JP4.56 60.81,3.98 | 60.81,10.77 58.55,13.03 58.55,21.03 | 61.75,34.44 54.15,42.04 v54.15,45.16
D28  (via drill 0.51)
  Top 0.279: U1.72 52.91,42.02 52.91,41.45 53.95,40.41
  Top 0.305: 53.95,40.41 v53.95,39.62
  Bottom 0.305: JP4.27 59.83,10.81 57.91,12.72 57.78,22.96 60.22,25.6 60.3,33.83 54.94,39.62 v53.95,39.62
D29  (via drill 0.51)
  Top 0.279: 55.5,43.9 U1.71
  Top 0.305: v55.5,44.83 55.5,43.9
  Bottom 0.229: 62.81,3.98 62.81,10.82
  Bottom 0.254: 61.95,39.8 61.95,40.95 62.56,41.55 63.17,41.55 63.73,41 63.73,39.57 63.32,39.17 | 63.32,28.15 63.32,27.38 61.67,25.73 61.67,24.74 59.69,22.76 59.69,22.17 | 63.32,33.27 64.36,32.18 64.36,30.02 63.32,28.93
  Bottom 0.279: 59.74,20.45 59.69,22.17
  Bottom 0.305: JP4.57 62.81,3.98 | 62.81,10.82 59.74,13.89 59.74,20.45 | 63.32,28.15 63.32,28.93 | 63.32,33.27 63.32,39.17 | 61.95,39.8 61.52,39.37 59.69,39.37 55.5,43.56 v55.5,44.83
D30  (via drill 0.51)
  Top 0.279: U1.60 60.83,41.45
  Top 0.305: v62.84,40.56 62.84,40.72 62.1,41.45 60.83,41.45
  Bottom 0.254: 59.11,22.49 59.11,22.86 61.21,24.97 61.21,26.29 61.52,26.59 61.87,26.59 62.84,27.56 62.84,29.29 63.91,30.35 63.91,31.9 62.81,32.99 62.81,35.51 62.84,35.53 v62.84,40.56
  Bottom 0.279: 59.16,20.73 59.11,22.49
  Bottom 0.305: JP4.28 61.83,10.87 59.16,13.54 59.16,20.73
DTR
  Top 0.305: JP2.1 66.12,59.77 67.44,61.09 68.59,61.09 C2.2
EN_I2C  (via drill 0.38)
  Top 0.254: 60.7,30.75 61.38,30.75 v62.16,31.53 | U5.8 61.55,27.69 v61.35,27.89
  Top 0.279: U1.47 60.7,30.75
  Bottom 0.254: 61.4,27.8 v61.35,27.89 61.3,30.66 v62.16,31.53
FTDI_VCC
  Top 0.254: JP2.4 57.15,62.1 58.29,63.25 60.58,63.25 | 60.58,63.25 60.58,58.04 59.69,57.15 59.69,53.24 59.41,52.96 R32.2 | Q6.1 64.71,53.06 65.76,53.06 66.04,53.34 66.04,56.13 65.15,57.02 64.14,57.02 63.5,57.66 63.5,62.61 62.87,63.25 60.58,63.25
  Top 0.305: Q1.1 58.9,52.91 R32.2 | 64.71,53.06 R37.2
GND  (via drill 0.51)
  Top 0.254: 60.91,42.95 62.2,44.24 C9.2 | U1.32 53.85,27 v53.09,27.81 | U5.4 65.95,29.19 66.24,29.49 66.24,30.53 v65.86,30.91
  Top 0.279: U1.81 46.66,43.38 | U1.11 42.54,26.7 | U1.62 60.91,42.95
  Top 0.305: 42.54,26.7 C22.1 | U1.99 42.59,34.72 v43.54,35.13 | 46.66,43.38 46.66,44.76
  Bottom 0.305: v43.54,35.13 44.45,35.41 44.45,35.56
  other vias: 10.03,41.27 11.81,41.27 56.72,25.15 15.44,9.7 15.52,15.19 20.95,40.97 21.84,33.99 39.73,26.52 71.4,15.16 69.27,14.27 54.94,22.61 60.76,48.36 46,62.28 52.65,31.7 51.59,27.99 66.27,46.51 49.86,45.06 69.6,33.12 67.39,35 67.25,26.85
  pour Bottom (isolate 0.305): 0,0 73.66,0 73.66,72.39 0,72.39
  pour Top (isolate 0.305): 0,0 0,72.39 73.66,72.39 73.66,0
N$1
  Top 0.305: R36.1 22.1,56.64 23.3,57.85 R34.2
N$2
  Top 0.254: U1.44 60.14,29.19 U5.5
N$3
  Top 0.305: U2.1 39.56,62.46 R16.1 42.12,62.65 42.98,61.8 42.98,60.15 SJ2.2
N$4
  Top 0.305: D3.A 54.48,18.59 R6.2
N$5
  Top 0.305: R5.1 5.54,36.61 D1.A
N$6  (via drill 0.51)
  Top 0.279: R22.1 20.32,13.01 v19.94,12.62
  Top 0.305: JP4.7 18.34,3.96 v17.37,3.96
  Bottom 0.203: 16.84,6.04 16.84,4.8
  Bottom 0.279: 18.69,10.74 19.94,11.99 v19.94,12.62
  Bottom 0.305: 18.69,10.74 18.69,9.68 17.12,8.1 16.84,7.85 16.84,6.04 | 16.84,4.8 16.84,4.5 v17.37,3.96
N$7  (via drill 0.51)
  Top 0.305: R23.1 20.88,11.56 v19.79,10.46
  Bottom 0.229: 18.82,7.62 18.82,3.4
  Bottom 0.305: 18.82,3.4 17.83,2.41 JP4.36 | v19.79,10.46 19.79,8.59 18.82,7.62
N$8
  Top 0.305: Q2.1 9.09,39.31 R11.2
N$9
  Top 0.305: U3.1 8.06,47.97 9.86,47.97 R4.1 11.01,47.84 11.56,48.39 11.56,51.07 | 11.56,51.07 R1.2 | 11.56,51.07 10.08,51.07 R7.2
N$10
  Top 0.305: U4.1 21.55,48.11 R19.1 23.03,48.68 23.69,49.34 R8.2 | R21.2 R35.2 25.15,52.5 25.08,52.57 R8.2 | R8.2 23.64,52.62 R36.2
N$11
  Top 0.305: R20.1 17.21,36.64 D4.A
N$12
  Top 0.305: Q3.1 8.71,33.71 7.87,34.54 7.87,36.58 6.04,38.41 Q2.3 R10.1
N$13
  Top 0.305: Q4.1 20.53,39.47 R14.2
N$14
  Top 0.254: 19.56,36.32 19,36.88 18.36,36.88 17.48,37.77 17.48,38.4
  Top 0.305: R12.1 Q4.3 17.48,38.4 | Q5.1 20.47,33.76 19.56,34.67 19.56,36.32
N$15
  Top 0.254: SJ1.1 4.79,60.84 5.08,60.84
  Top 1.016: F1.1 5.08,60.84 6.1,60.84 D5.C
N$16
  Top 0.254: R32.1 58.55,54.71 58.55,59.44 58.93,59.82 59.64,59.82
  Top 0.305: R32.1 57.28,54.67 Q1.2 | JP2.3 59.64,59.82
N$17
  Top 0.305: SJ2.1 40.22,60.07 R18.2
N$18
  Top 0.305: SJ2.3 46.14,60.07 R15.2
N$19
  Top 0.305: JP4.6 21.26,10.08 R24.1
N$20
  Top 0.229: 22.84,4.7 22.84,7.58
  Top 0.305: JP4.35 15.91,1 17.2,2.29 20.42,2.29 22.84,4.7 | R25.1 23.81,8.56 22.84,7.58
N$21
  Top 0.305: U3.2 9.31,50.22 R4.2
  Top 0.61: 5.46,44.25 SJ3.3
  Top 1.016: U3.2 5.21,50.22 | 5.21,50.22 U3.4 | 5.46,45.72 5.46,49.96 5.21,50.22 | C5.A 10.86,45.63 C4.1 5.55,45.63 5.46,45.72 | 5.46,45.72 5.46,44.25
N$22
  Top 0.305: R10.2 1.72,39.94 1.65,40.01
  Top 0.61: 4.65,41.73 SJ3.2
  Top 1.016: 4.65,41.73 4.62,41.63 4.65,41.6 4.06,41.02 2.67,41.02 1.65,40.01 1.65,33.91 Q3.3 3.63,26.98 4.34,26.27 C3.+
N$23
  Top 0.305: R12.2 14.05,40.56 14.03,40.58
  Top 0.61: 16.66,41.68 SJ4.2
  Top 1.016: 16.66,41.68 16.13,41.15 14.61,41.15 14.03,40.58 13.97,40.51 13.97,33.3 Q5.3 15.39,26.64 15.82,26.22 C8.+
N$24
  Top 1.016: JP1.PWR 18.83,59.56 D5.A
N$25
  Top 0.305: R31.2 26.44,67.12 D6.A
N$26
  Top 0.305: R37.1 64.63,54.96 Q6.2 62.23,55.47 JP2.2
N$27
  Top 0.254: U1.43 59.93,28.69 U5.6
N$28
  Top 0.279: U6.4 29.27,47.82 29.72,47.37 29.72,46.48 29.34,46.1 28.28,46.1 C20.1
N$73
  Top 0.254: U1.33 55.83,25.73 55.83,24.55 Y1.3
N$74
  Top 0.254: U1.34 56.2,26.06 57.71,26.06 Y1.1
PB0  (via drill 0.51)
  Top 0.279: U1.19 44.65,23.16
  Top 0.305: 44.65,23.16 v44.7,22.53 | v50.83,3.56 51.38,3.56 51.69,3.25 66.93,3.25 v67.51,3.83
  Bottom 0.203: 50.8,6.35 50.8,4.95 50.83,4.93
  Bottom 0.305: v44.7,22.53 44.65,19.71 47.3,17.07 47.3,15.93 48.67,14.55 48.67,12.17 50.83,10.01 50.83,6.38 50.8,6.35 | v50.83,3.56 50.83,4.93 | v67.51,3.83 65.83,2.15 JP4.60
PB1  (via drill 0.51)
  Top 0.229: 30.81,7.32 30.81,4.88
  Top 0.279: U1.20 48.82,26.61
  Top 0.305: 48.82,26.61 48.82,27.43 47.4,28.85 v47.27,28.85 | v36.55,32.72 31.37,27.53 v31.37,25.7 | v31.37,9.02 31.37,7.87 30.81,7.32 | 30.81,4.88 30.81,4.72 31.11,4.42 64.8,4.42 JP4.30
  Bottom 0.203: 69.7,16.36 69.7,18.92
  Bottom 0.305: 69.7,16.36 67.31,13.97 67.31,6.93 JP4.30 | 69.7,18.92 70.95,20.18 JP3.3 | v47.27,28.85 46.2,29.92 43.69,29.92 39.98,33.63 38.43,33.63 37.52,32.72 v36.55,32.72 | v31.37,25.7 v31.37,9.02
PB2  (via drill 0.51)
  Top 0.279: U1.21 46.56,23.65 | v66.29,8.79 67.87,8.79 v68.25,9.17
  Top 0.305: 46.56,23.65 46.61,23.06 42.81,19.44 | 42.81,19.44 42.65,19.28 | v38.25,19.86 40.23,17.88 41.81,17.88 42.57,18.64 42.57,19.2 42.81,19.44 | v38.25,8.38 40.74,8.38 41.88,7.24 46.99,7.24 47.7,6.53 68.25,6.53 v68.61,6.88
  Bottom 0.305: JP3.4 66.78,18.71 66.78,9.27 v66.29,8.79 | v38.25,19.86 38.3,8.51 v38.25,8.38 | JP4.59 63.83,1.6 67.31,5.08 67.31,5.56 68.43,6.68 v68.61,6.88 68.61,8.81 v68.25,9.17
PB3  (via drill 0.51)
  Top 0.279: U1.22 49.58,25.96
  Top 0.305: 49.58,25.96 v49.58,28.27 | v36.7,31.34 36.14,31.34 32.61,27.81 32.61,22.91 40.84,14.68 v42.32,14.68 | JP3.1 70.38,17.23 70.38,14.33 72.24,12.47 72.24,10.46 70.43,8.66 69.09,8.66 68.5,8.08 66.98,8.08 66.42,7.52 v64.77,7.52 64.39,7.14 48.23,7.14 47.09,8.28 42.85,8.28 v42.75,8.18
  Bottom 0.305: v36.7,31.34 36.96,31.34 38.53,32.92 39.34,32.92 43.05,29.21 44.88,29.21 46.1,27.99 49.3,27.99 v49.58,28.27 | v42.32,14.68 42.32,8.61 v42.75,8.18 | JP4.29 63.83,6.58 v64.77,7.52
RAW  (via drill 0.51)
  Top 0.254: 4.61,59.45 SJ1.2
  Top 0.279: U6.3 25.81,47.75 25.15,47.75 24.77,48.13 24.77,49.72 | 24.77,49.72 v24.77,50.93 | U6.1 24.77,49.72
  Top 0.61: 3.83,44.25 SJ3.1 | 15.85,44.25 SJ4.1
  Top 1.016: F1.2 4.45,58.04 | 4.45,58.04 5.68,56.81 5.68,55.41 C15.A 8.19,55.37 | 4.45,58.04 4.61,58.2 4.61,59.45 | U3.3 8.19,52.72 8.19,55.37 | C11.A 37.39,69.42 U2.3 37.31,67 35.28,67 34.44,66.17 34.44,62.83 33.77,62.15 26.25,62.15 20.28,56.19 C6.A 19.73,52.82 U4.3 v16.09,52.73 13.45,55.37 v8.26,55.37 8.19,55.37 | v2.92,46.48 3.83,45.57 3.83,44.25 | v14.61,46.23 15.85,44.98 15.85,44.25
  Bottom 0.279: v24.77,50.93 22.96,52.73 v16.09,52.73
  Bottom 1.016: v8.26,55.37 2.92,50.04 v2.92,46.48 1.02,44.58 1.02,9.98 6.96,4.04 13.83,4.04 | v14.61,46.23 14.61,51.24 v16.09,52.73 | JP4.34 13.83,4.04 | JP4.4 13.83,4.04
RESET  (via drill 0.51)
  Top 0.254: R2.1 69.55,55.65 71.88,53.31 S1.4 | 64.8,14.71 64.8,23.06 68.63,26.9 v69.42,26.9
  Top 0.279: U1.30 58.42,21.01 | 58.55,17.5 57.51,16.46 v50.04,16.46 | 64.8,14.71 65.46,14.05 65.46,11.53 65.25,11.33
  Top 0.305: C2.1 68.63,57.49 R2.1 | S1.4 S1.3 71.88,23.81 JP3.5 | 65.25,11.33 63.7,9.78 v53.44,9.78 | 58.55,17.5 58.55,20.89 58.42,21.01
  Bottom 0.279: v50.04,16.46 50.04,15.47 50.8,14.71
  Bottom 0.305: v69.42,26.9 70.95,25.36 JP3.5 | v53.44,9.78 53.44,12.06 50.8,14.71
RX0  (via drill 0.51)
  Top 0.279: U1.2 40.29,30.81 | R33.1 55.25,50.77 v49.86,50.77
  Top 0.305: Q1.3 55.05,51.1 R33.1 | 40.29,30.81 38.68,30.81 37.77,29.9 v36.17,29.9
  Bottom 0.305: v36.17,29.9 35.41,30.66 35.41,35.84 44.4,44.83 47.55,44.83 48.16,45.44 48.16,50.49 48.46,50.8 v49.86,50.77
RX1  (via drill 0.51)
  Top 0.254: 63.65,18.57 63.65,23.34 65.24,24.93 | U1.45 60.25,29.79 62.99,29.79 63.79,29 63.79,28.67
  Top 0.279: 63.79,28.67 63.79,27.05 65.24,25.6 65.24,24.93 | 59.03,11.73 62.38,15.09 62.38,17.3 63.65,18.57
  Top 0.305: v52.4,11.73 59.03,11.73
  Bottom 0.229: 52.86,4.57 52.86,6.17
  Bottom 0.305: JP4.52 52.86,4.03 52.86,4.57 | v52.4,11.73 52.4,7.9 52.86,7.44 52.86,6.17
RX2  (via drill 0.51)
  Top 0.279: 41.67,25.12 U1.12
  Top 0.305: v40.01,25.12 41.67,25.12
  Bottom 0.229: 48.84,8.31 48.84,2.01
  Bottom 0.305: 48.84,2.01 JP4.51 | 48.84,8.31 48.06,9.09 48.06,14.25 46.66,15.65 46.66,16.79 44.02,19.43 44.02,21.67 41.86,23.82 41.86,24.36 41.1,25.12 v40.01,25.12
RX3  (via drill 0.51)
  Top 0.279: U1.63 65.01,47.75
  Top 0.305: JP4.50 45.83,1.1 46.79,2.06 66.5,2.06 v67.49,1.07 | 65.01,47.75 v70.1,47.75
  Bottom 0.305: v70.1,47.75 73.05,44.81 73.05,2.39 71.42,0.76 67.79,0.76 v67.49,1.07
SCL1  (via drill 0.51)
  Top 0.254: U5.2 66.5,28.19 67.36,29.06 67.36,29.87
  Top 0.279: 67.36,29.87 67.36,33.76 66.06,35.05 62.08,35.05 61.32,34.29 v53.34,34.29
  Bottom 0.203: 54.86,4.7 54.86,6.1
  Bottom 0.279: JP4.53 54.86,4.03 54.86,4.7 | 55.12,7.62 55.12,10.54 54.74,10.92 54.74,13.84 52.32,16.26 52.32,20.19 52.45,20.32 52.45,23.75 56.64,27.94 56.64,32.26 54.61,34.29 v53.34,34.29
  Bottom 0.305: 55.12,7.62 54.86,7.37 54.86,6.1
SDA1  (via drill 0.51)
  Top 0.254: U5.3 66.21,28.69 66.83,29.31 66.83,30.2
  Top 0.279: v48.01,19.05 48.01,20.57 v49.66,22.23 | v54.36,32.89 59.56,32.89 60.33,33.66 61.54,33.66 62.33,34.44 65.86,34.44 66.83,33.48 66.83,30.2
  Bottom 0.279: JP4.23 51.83,10.78 50.29,12.32 50.29,14.1 48.77,15.62 48.77,18.29 v48.01,19.05 | v54.36,32.89 56.01,31.24 55.86,28.05 50.03,22.23 v49.66,22.23
TX0  (via drill 0.51)
  Top 0.254: Q6.3 60.63,56.83 61.21,57.4 61.21,61.85 61.47,62.1 v62.05,62.1
  Top 0.279: U1.3 40.36,30.18
  Top 0.305: Q6.3 60.63,51.57 R17.1 | 40.36,30.18 38.94,30.18 37.08,28.32 v35.2,28.32 | v60.91,64.75 57.66,64.75 55.98,63.07 55.98,57.48 51.97,53.47 v50.01,53.47
  Bottom 0.254: v60.91,64.75 62.05,63.6 v62.05,62.1
  Bottom 0.305: v35.2,28.32 34.77,28.75 34.77,36.09 44.12,45.44 47.24,45.44 47.47,45.67 47.47,50.93 v50.01,53.47
TX1  (via drill 0.51)
  Top 0.254: 65.86,24.87 64.16,23.16 64.21,18.26 | U1.46 60.49,30.25 63.83,30.25 64.39,29.69 64.39,28.96
  Top 0.279: 64.39,28.96 64.4,27.23 65.86,25.77 65.86,24.87 | 59.18,10.74 62.94,14.5 62.94,16.99 64.21,18.26
  Top 0.305: v49.33,9.42 50.65,10.74 59.18,10.74
  Bottom 0.305: JP4.22 49.83,8.92 v49.33,9.42
TX2  (via drill 0.51)
  Top 0.279: 41.18,23.93 U1.13
  Top 0.305: v40.84,23.93 41.18,23.93
  Bottom 0.305: v40.84,23.93 43.41,21.36 43.41,19.1 46.1,16.41 46.1,15.29 46.91,14.48 46.91,6.37 JP4.21
TX3  (via drill 0.51)
  Top 0.279: U1.64 65.7,49.15
  Top 0.305: v71.82,6.74 73,5.56 73,2.34 71.42,0.76 69.09,0.76 67.21,2.64 45.39,2.64 v44.86,1.98 | 65.7,49.15 v70.03,49.15
  Bottom 0.305: v70.03,49.15 68.99,48.11 68.99,47.04 72.52,43.51 72.52,7.44 v71.82,6.74 | JP4.20 45.83,3.08 v44.86,1.98
V1
  Top 0.305: Q3.2 6.17,32.41 R5.2
  Top 1.016: Q3.2 6.17,31.17 8.76,28.57 8.76,17.78 10.41,16.13 10.41,11.81 9.96,11.35 R3.2 9.87,10.58 | JP4.32 JP4.2 9.83,10.54 9.87,10.58 | C17.1 9.87,10.58
V2
  Top 0.305: Q5.2 17.93,32.63 R20.2
  Top 1.016: JP4.33 JP4.3 11.88,6.7 C18.1 11.86,9.08 R28.2 11.86,19.61 13.72,21.46 19.18,21.46 21.21,23.5 21.21,27.43 17.93,30.71 Q5.2
VCC  (via drill 0.38, 0.51)
  Top 0.203: 69.7,19.09 v69.7,24.13
  Top 0.254: v70.59,36.52 71.12,37.06 71.12,53.3 R2.2 67.8,56.52 67.06,56.52 66.67,56.13 66.67,53.21 64.45,50.99 R17.2 | 60.41,41.74 61.71,43.04 C9.1 | U1.10 43.71,28.57 43.18,28.57 42.51,27.91 C22.2 | U5.7 63.04,28.19 63.27,27.96 63.27,25.92 v64.14,25.06 | U2.4 30.34,63.92 R31.1
  Top 0.279: U1.61 60.41,41.74 | 43.27,33.34 U1.100 38.02,38.59 | U1.80 47.37,43.38 | U1.10 45.24,30.11 | U1.31 53.55,26.59 | U1.61 54.37,35.7 50.66,35.7 48.51,33.55 | 52.91,26.59 51.61,26.59 50.52,27.69
  Top 0.305: U1.61 | R17.2 62.91,49.83 62.36,49.28 57.15,49.28 | 38.02,38.59 C19.2 | 47.37,43.38 47.37,44.35 48.95,45.93 C21.2 | U1.80 49.02,41.73 49.02,40.97 45.26,37.21 45.26,35.33 | 57.15,49.28 48.87,49.28 48.51,49.63 | R33.2 57.01,49.42 57.15,49.28 | 45.24,30.11 45.24,30.48 | 45.24,30.48 45.24,30.76 43.27,32.73 43.27,33.34 45.26,35.33 | 45.24,30.48 46.91,30.48 48.26,29.13 50.16,29.13 50.52,28.78 50.52,27.69 | JP3.2 69.7,19.09 | 48.51,33.55 47.04,33.55 45.26,35.33 | 53.55,26.59 52.91,26.59
  Top 1.016: R16.2 42.45,64.35 C10.A 46.87,64.26 48.51,62.61 48.51,49.63 48.51,46.65 C21.2 | R16.2 39.33,64.77 U2.2 | v40.06,65.89 39.75,65.58 R16.2 | U2.4 31.57,65.15 v31.57,67.82
  Bottom 0.279: 68.3,25.53 68.5,25.32 | v64.14,25.06 67.6,25.03 68.2,25.63
  Bottom 0.305: v69.7,24.13 68.5,25.32 68.2,25.63 68.2,27.43 70.59,29.82 v70.59,36.52
  Bottom 1.016: v31.57,67.82 33.5,65.89 v40.06,65.89
VREG2OUT
  Top 0.305: U4.2 22.08,50.42 R19.2
  Top 0.61: 17.48,44.25 SJ4.3
  Top 1.016: U4.4 17.78,50.42 | 17.78,50.42 U4.2 | 17.48,45.72 17.48,50.11 17.78,50.42 | C14.A 22.61,45.83 C13.1 17.59,45.83 17.48,45.72 | 17.48,45.72 17.48,44.25

## Text on the board
Bottom: V11
tPlace: 10uF | VOLTAGE | POWER | 1K | 240 | 10uF | PTC | LM1117 | 3.3V | VCC | 5V | BYPASS / PTC | R34 | 390 | BLK | GRN | 0.1uF | 10uF | 715 | MBRA140 | SERIAL COM | 10K | R7 | R1 | R36 | R8 | R35 | R21 | 10K | 10uF | 10uF | 10K | BSS138 | RESET | BSS138 | R19 | MIC5205 | R4 | 10K | 10K | LM1117 | 0.1uF | 10uF | LM1117 | 0.1uF | 10uF | 10nF | RAW | V1 | VREG1 | RAW | V2 | VREG2 | 0.1uF | 100 | 100 | 10K | 10K | 0.1uF | MEGA2560 | npn | npn | 0.1uF | 1K | V1 | 1K | V2 | P-MOSFET | P-MOSFET | 0.1uF | 0.1uF | PCA9306 | 100uF | 100uF | Testbed # | 16MHz | 1K | STAT | 22M | 100K | 100K | 1K | The Flying Jalapeno | 10K | 10K | 1K | 10K | 10K | 1K | (For Spicy Testbeds) | 22M | 0.1uF | 0.1uF | 1K
bPlace: GND | V1 | V2 | RAW | CS1 | PASS | PASS | PT | A1 | A3 | A5 | A7 | A9 | A11 | D2 | D4 | D6 | D8 | D10 | D12 | Tx3 | Tx2 | Tx1 | SDA | D22 | D24 | D26 | D28 | D30 | D50 | D52 | GND | V1 | V2 | RAW | FAIL | FAIL | PT | A0 | A2 | A4 | A6 | A8 | A10 | A12 | D3 | D5 | D7 | D9 | D11 | D13 | Rx3 | Rx2 | Rx1 | SCL | D23 | D25 | D27 | D29 | CS2 | D51 | D53
tDocu: Pete Lewis